# EAGLE schematic lpc1347 (EAGLE 6.2)
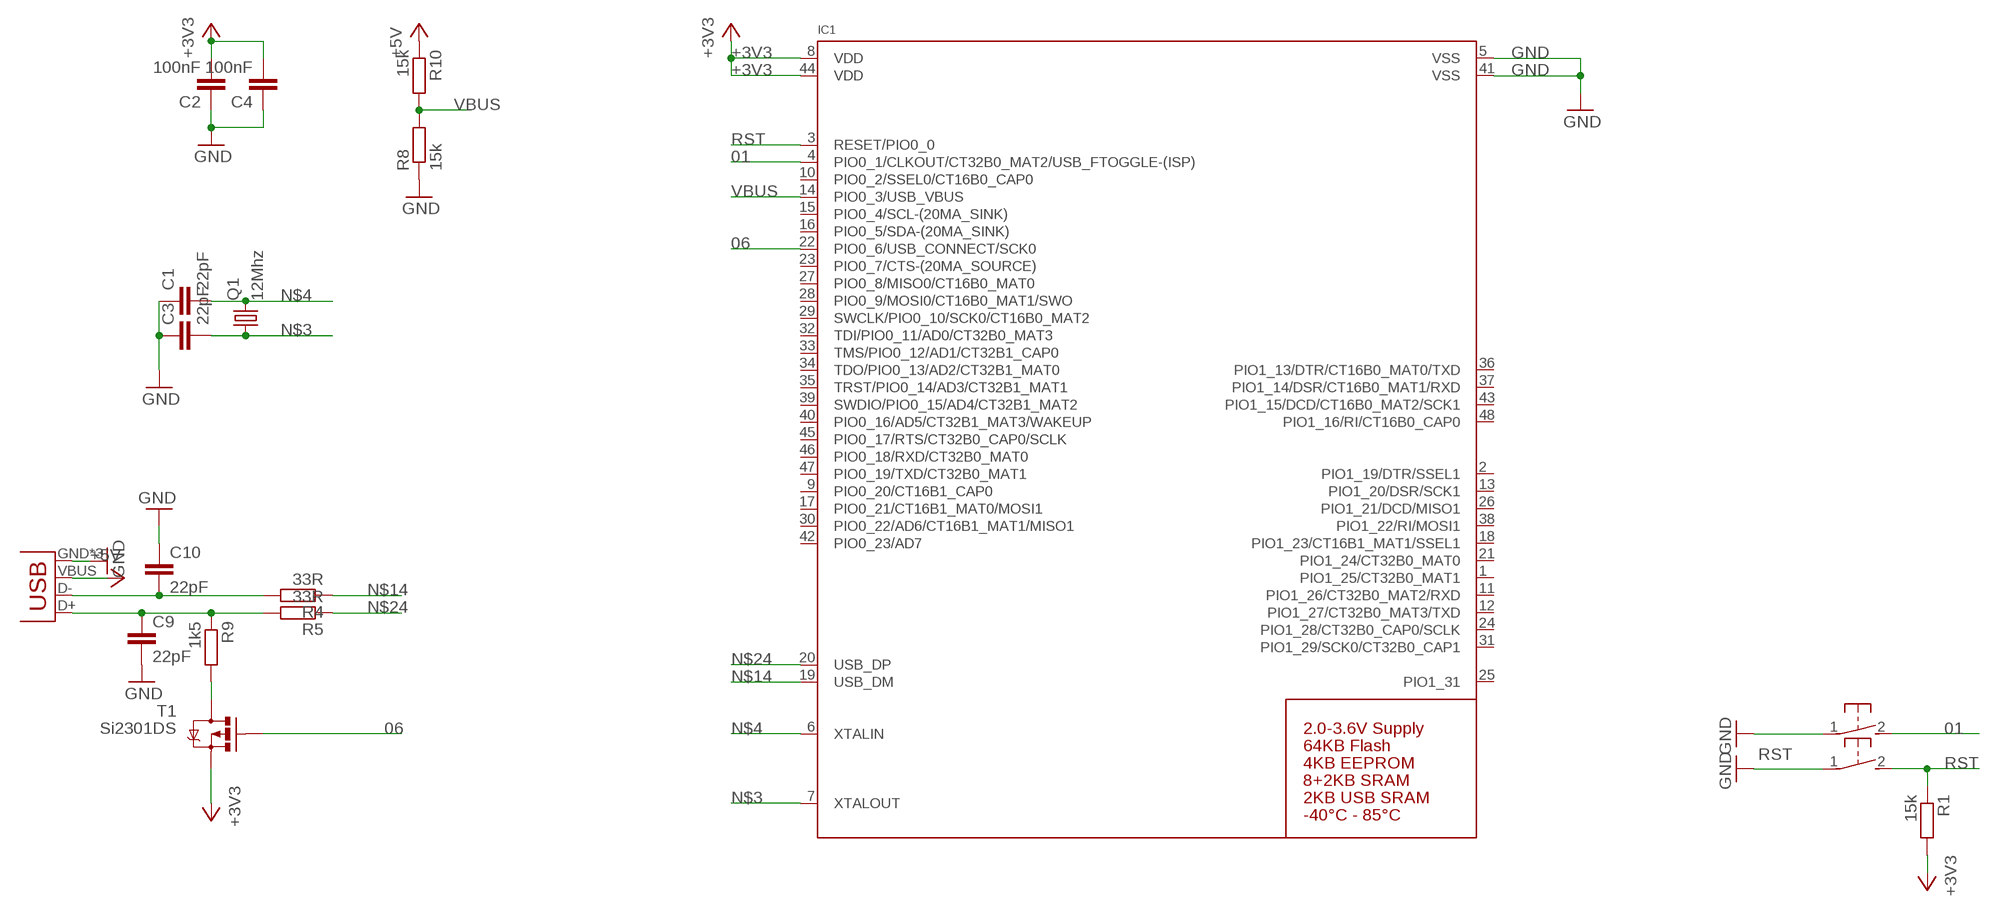
[diagram p0: schematic, sheet 1]

## Parts
BL/SW2  SWITCH_MCTAEF  [SWITCH_MCTAEF]
C1  22pF  C-EUC0402  [C0402]
C2  100nF  C-EUC0402  [C0402]
C3  22pF  C-EUC0402  [C0402]
C4  100nF  C-EUC0402  [C0402]
C9  22pF  C-EUC0402  [C0402]
C10  22pF  C-EUC0402  [C0402]
IC1  LPC1347_QFP48  [LQFP48]
Q1  12Mhz  MT-OSCILLATOR  [MT]
R1  15k  R-EU_R0402  [R0402]
R4  33R  R-EU_R0402  [R0402]
R5  33R  R-EU_R0402  [R0402]
R8  15k  R-EU_R0402  [R0402]
R9  1k5  R-EU_R0402  [R0402]
R10  15k  R-EU_R0402  [R0402]
RST  SWITCH_MCTAEF  [SWITCH_MCTAEF]
T1  Si2301DS  MOSFET-PCHANNEL  [SOT23]
X1  USB-MICROB  [USB-MICROB]

## Nets
01: BL/SW2.2 IC1.4(PIO0_1/CLKOUT/CT32B0_MAT2/USB_FTOGGLE-(ISP))
06: IC1.22(PIO0_6/USB_CONNECT/SCK0) T1.1(G)
+3V3: C2.2 C4.2 IC1.8(VDD) IC1.44(VDD) R1.2 T1.2(S)
+5V: R10.1 X1.VBUS
GND: BL/SW2.1 C1.1 C2.1 C3.1 C4.1 C9.2 C10.1 IC1.5(VSS) IC1.41(VSS) R8.1 RST.1 X1.GND X1.MT1(GND) X1.MT2(GND)
N$3: C3.2 IC1.7(XTALOUT) Q1.1
N$4: C1.2 IC1.6(XTALIN) Q1.3
N$10: C9.1 R5.2 R9.1 X1.D+
N$11: C10.2 R4.2 X1.D-
N$14: IC1.19(USB_DM) R4.1
N$20: R9.2 T1.3(D)
N$24: IC1.20(USB_DP) R5.1
RST: IC1.3(RESET/PIO0_0) R1.1 RST.2
VBUS: IC1.14(PIO0_3/USB_VBUS) R8.2 R10.2
Unconnected: IC1.1(PIO1_25/CT32B0_MAT1) IC1.2(PIO1_19/DTR/SSEL1) IC1.9(PIO0_20/CT16B1_CAP0) IC1.10(PIO0_2/SSEL0/CT16B0_CAP0) IC1.11(PIO1_26/CT32B0_MAT2/RXD) IC1.12(PIO1_27/CT32B0_MAT3/TXD) IC1.13(PIO1_20/DSR/SCK1) IC1.15(PIO0_4/SCL-(20MA_SINK)) IC1.16(PIO0_5/SDA-(20MA_SINK)) IC1.17(PIO0_21/CT16B1_MAT0/MOSI1) IC1.18(PIO1_23/CT16B1_MAT1/SSEL1) IC1.21(PIO1_24/CT32B0_MAT0) IC1.23(PIO0_7/CTS-(20MA_SOURCE)) IC1.24(PIO1_28/CT32B0_CAP0/SCLK) IC1.25(PIO1_31) IC1.26(PIO1_21/DCD/MISO1) IC1.27(PIO0_8/MISO0/CT16B0_MAT0) IC1.28(PIO0_9/MOSI0/CT16B0_MAT1/SWO) IC1.29(SWCLK/PIO0_10/SCK0/CT16B0_MAT2) IC1.30(PIO0_22/AD6/CT16B1_MAT1/MISO1) IC1.31(PIO1_29/SCK0/CT32B0_CAP1) IC1.32(TDI/PIO0_11/AD0/CT32B0_MAT3) IC1.33(TMS/PIO0_12/AD1/CT32B1_CAP0) IC1.34(TDO/PIO0_13/AD2/CT32B1_MAT0) IC1.35(TRST/PIO0_14/AD3/CT32B1_MAT1) IC1.36(PIO1_13/DTR/CT16B0_MAT0/TXD) IC1.37(PIO1_14/DSR/CT16B0_MAT1/RXD) IC1.38(PIO1_22/RI/MOSI1) IC1.39(SWDIO/PIO0_15/AD4/CT32B1_MAT2) IC1.40(PIO0_16/AD5/CT32B1_MAT3/WAKEUP) IC1.42(PIO0_23/AD7) IC1.43(PIO1_15/DCD/CT16B0_MAT2/SCK1) IC1.45(PIO0_17/RTS/CT32B0_CAP0/SCLK) IC1.46(PIO0_18/RXD/CT32B0_MAT0) IC1.47(PIO0_19/TXD/CT32B0_MAT1) IC1.48(PIO1_16/RI/CT16B0_CAP0)

## Library data of the parts
BL/SW2 RST = seb:SWITCH_MCTAEF
C1-C4 C9 C10 = rcl:C-EU: CAPACITOR, European symbol
IC1 = microbuilder:LPC1347_QFP48: LPC1347 - ARM Cortex M3 72MHz MCU Supply: 2.0-3.6V 12-bit 500kHz ADC Flash: 64KB EEPROM: 4KB SRAM: 8KB SRAM0 + 2KB SRAM1 + 2KB USB Temp: -40°C - 85°C
Q1 = seb:MT-OSCILLATOR
R1 R4 R5 R8-R10 = rcl:R-EU_: RESISTOR, European symbol
T1 = SparkFun:MOSFET-PCHANNEL
X1 = SparkFun-Connectors:USB: USB Connectors USB-B-PTH is fully proven SKU : PRT-00139 USB-miniB is fully proven SKU : PRT-00587 USB-A-PCB is untested. USB-A-H is throughly reviewed, but untested. Spark Fun Electronics SKU : PRT-00437 USB-B-SMT is throughly reviewed, but untested. Needs silkscreen touching up. USB-A-S has not been used/tested USB-MB-H has not been used/tested